# Altium schematic sheet InterfacesB_SHIFTER_LEDS.SchDoc
size A; DocumentNumber: 10; SheetNumber: 10
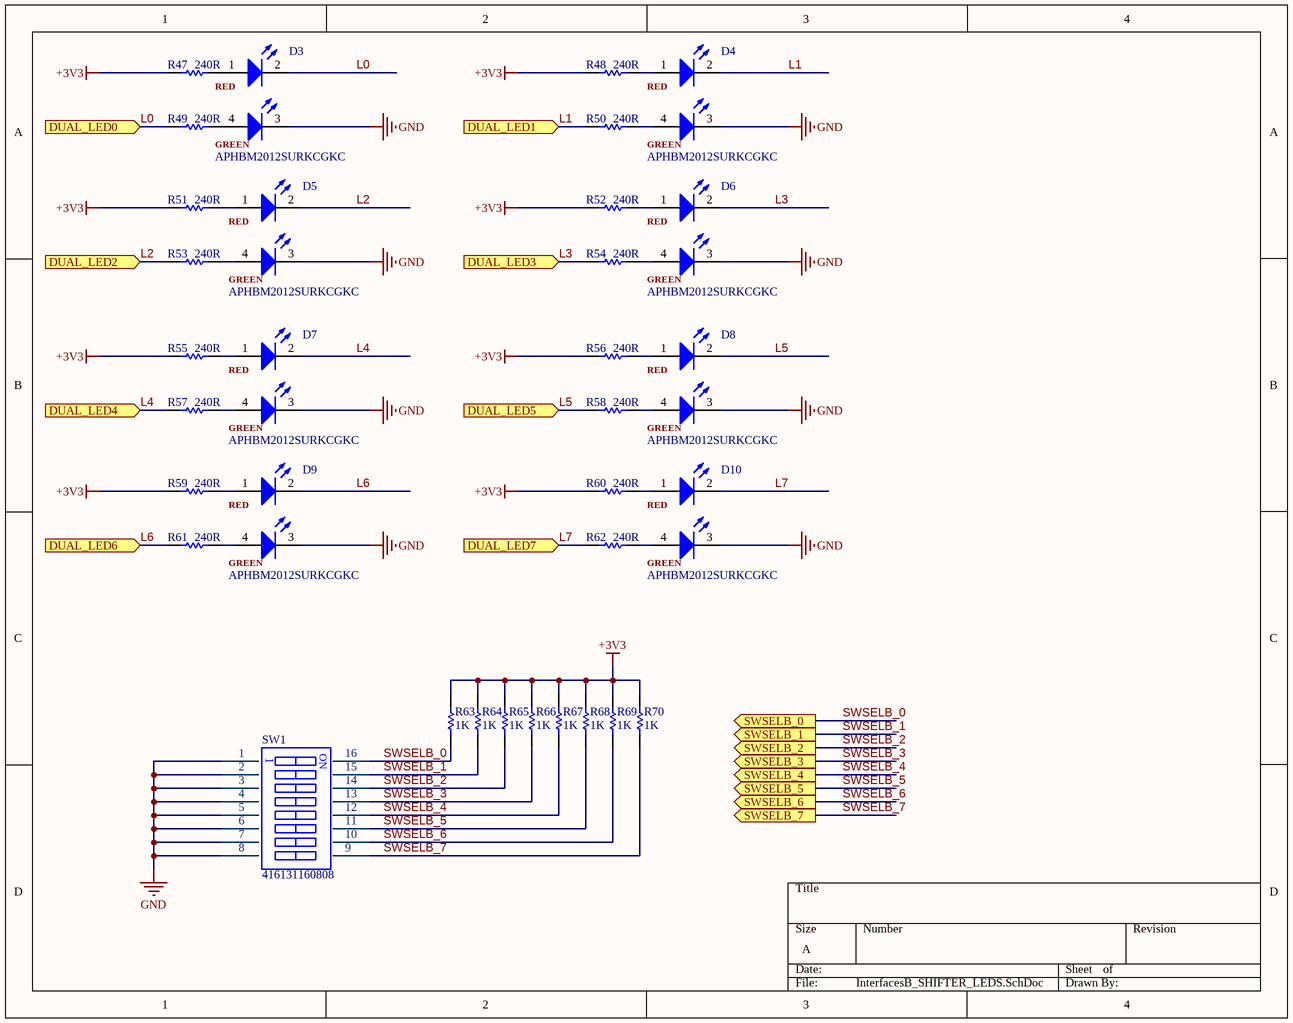
[diagram p0: InterfacesB_SHIFTER_LEDS.SchDoc]

## Parts
D3  APHBM2012SURKCGKC  [APHBM2012SURKCGKC]
D4  APHBM2012SURKCGKC  [APHBM2012SURKCGKC]
D5  APHBM2012SURKCGKC  [APHBM2012SURKCGKC]
D6  APHBM2012SURKCGKC  [APHBM2012SURKCGKC]
D7  APHBM2012SURKCGKC  [APHBM2012SURKCGKC]
D8  APHBM2012SURKCGKC  [APHBM2012SURKCGKC]
D9  APHBM2012SURKCGKC  [APHBM2012SURKCGKC]
D10  APHBM2012SURKCGKC  [APHBM2012SURKCGKC]
R47  value 240R  [RES_0805]  (hidden comment: RES_0805)
R48  value 240R  [RES_0805]  (hidden comment: RES_0805)
R49  value 240R  [RES_0805]  (hidden comment: RES_0805)
R50  value 240R  [RES_0805]  (hidden comment: RES_0805)
R51  value 240R  [RES_0805]  (hidden comment: RES_0805)
R52  value 240R  [RES_0805]  (hidden comment: RES_0805)
R53  value 240R  [RES_0805]  (hidden comment: RES_0805)
R54  value 240R  [RES_0805]  (hidden comment: RES_0805)
R55  value 240R  [RES_0805]  (hidden comment: RES_0805)
R56  value 240R  [RES_0805]  (hidden comment: RES_0805)
R57  value 240R  [RES_0805]  (hidden comment: RES_0805)
R58  value 240R  [RES_0805]  (hidden comment: RES_0805)
R59  value 240R  [RES_0805]  (hidden comment: RES_0805)
R60  value 240R  [RES_0805]  (hidden comment: RES_0805)
R61  value 240R  [RES_0805]  (hidden comment: RES_0805)
R62  value 240R  [RES_0805]  (hidden comment: RES_0805)
R63  value 1K  [RES_0805]  (hidden comment: RES_0805)
R64  value 1K  [RES_0805]  (hidden comment: RES_0805)
R65  value 1K  [RES_0805]  (hidden comment: RES_0805)
R66  value 1K  [RES_0805]  (hidden comment: RES_0805)
R67  value 1K  [RES_0805]  (hidden comment: RES_0805)
R68  value 1K  [RES_0805]  (hidden comment: RES_0805)
R69  value 1K  [RES_0805]  (hidden comment: RES_0805)
R70  value 1K  [RES_0805]  (hidden comment: RES_0805)
SW1  416131160808  [416131160808]

## Ports
DUAL_LED0 (in), DUAL_LED1 (in), DUAL_LED2 (in), DUAL_LED3 (in), DUAL_LED4 (in), DUAL_LED5 (in), DUAL_LED6 (in), DUAL_LED7 (in), SWSELB_0 (out), SWSELB_1 (out), SWSELB_2 (out), SWSELB_3 (out), SWSELB_4 (out), SWSELB_5 (out), SWSELB_6 (out), SWSELB_7 (out)

## Nets
+3V3: R47.2 R48.2 R51.2 R52.2 R55.2 R56.2 R59.2 R60.2 R63.2 R64.2 R65.2 R66.2 R67.2 R68.2 R69.2 R70.2
GND: D3.3 D4.3 D5.3 D6.3 D7.3 D8.3 D9.3 D10.3 SW1.1 SW1.2 SW1.3 SW1.4 SW1.5 SW1.6 SW1.7 SW1.8
L0: D3.2 R49.2 ; port DUAL_LED0
L1: D4.2 R50.2 ; port DUAL_LED1
L2: D5.2 R53.2 ; port DUAL_LED2
L3: D6.2 R54.2 ; port DUAL_LED3
L4: D7.2 R57.2 ; port DUAL_LED4
L5: D8.2 R58.2 ; port DUAL_LED5
L6: D9.2 R61.2 ; port DUAL_LED6
L7: D10.2 R62.2 ; port DUAL_LED7
SWSELB_0: R63.1 SW1.16 ; port SWSELB_0
SWSELB_1: R64.1 SW1.15 ; port SWSELB_1
SWSELB_2: R65.1 SW1.14 ; port SWSELB_2
SWSELB_3: R66.1 SW1.13 ; port SWSELB_3
SWSELB_4: R67.1 SW1.12 ; port SWSELB_4
SWSELB_5: R68.1 SW1.11 ; port SWSELB_5
SWSELB_6: R69.1 SW1.10 ; port SWSELB_6
SWSELB_7: R70.1 SW1.9 ; port SWSELB_7
NetD3_1: D3.1 R47.1
NetD3_4: D3.4 R49.1
NetD4_1: D4.1 R48.1
NetD4_4: D4.4 R50.1
NetD5_1: D5.1 R51.1
NetD5_4: D5.4 R53.1
NetD6_1: D6.1 R52.1
NetD6_4: D6.4 R54.1
NetD7_1: D7.1 R55.1
NetD7_4: D7.4 R57.1
NetD8_1: D8.1 R56.1
NetD8_4: D8.4 R58.1
NetD9_1: D9.1 R59.1
NetD9_4: D9.4 R61.1
NetD10_1: D10.1 R60.1
NetD10_4: D10.4 R62.1

## Notes on the sheet
- (in symbol 416131160808) ON
- (in symbol APHBM2012SURKCGKC) RED; GREEN

## Library data of the parts
SW1 = 416131160808: 8 POS DIP SW SMD
D3-D10 = APHBM2012SURKCGKC: Supplier 1: Digi-Key; Supplier Part Number 1: 754-1093-1-ND